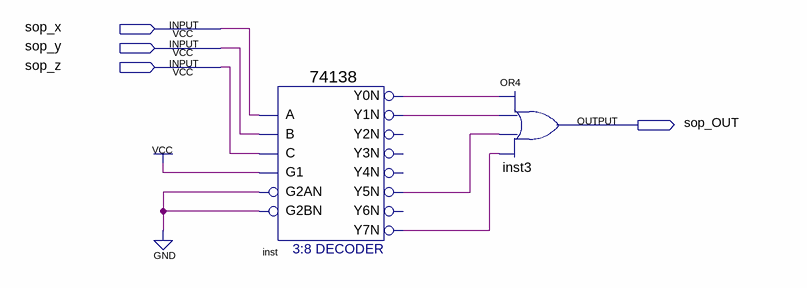
[diagram p0: schematic sheet]
// Quartus schematic week3p_sop_block.bdf as structural Verilog: 2 symbols, 4 pins
module week3p_sop_block (
  input  sop_x,
  input  sop_y,
  input  sop_z,
  output sop_OUT
);

  wire inst_y0n, inst_y1n, inst_y5n, inst_y7n;

  \74138  inst (
    .A(sop_x), .B(sop_y), .G1(1'b1), .C(sop_z), .G2AN(1'b0), .G2BN(1'b0), .Y0N(inst_y0n), .Y1N(inst_y1n),
    .Y5N(inst_y5n), .Y7N(inst_y7n));  // open: Y2N, Y3N, Y4N, Y6N
  or inst3 (sop_OUT, inst_y0n, inst_y1n, inst_y5n, inst_y7n);
endmodule
